# Altium schematic sheet Channel.SchDoc: CDR, Fanout, D-FF
size 420 x 297 mm; CheckedBy: E.Orzes F.Martina S.Baron; CompanyName: CERN; DrawnBy: E.Orzes; Organization: CERN; Address1: European Organization for Nuclear Research; Address2: CH-1211 Genève 23 - Switzerland; SheetNumber: 6; SheetTotal: 7; Projet: Phase Stable Link; DivGrp: EP-ESE; Designer: E.Orzes; ModifiedDate: -
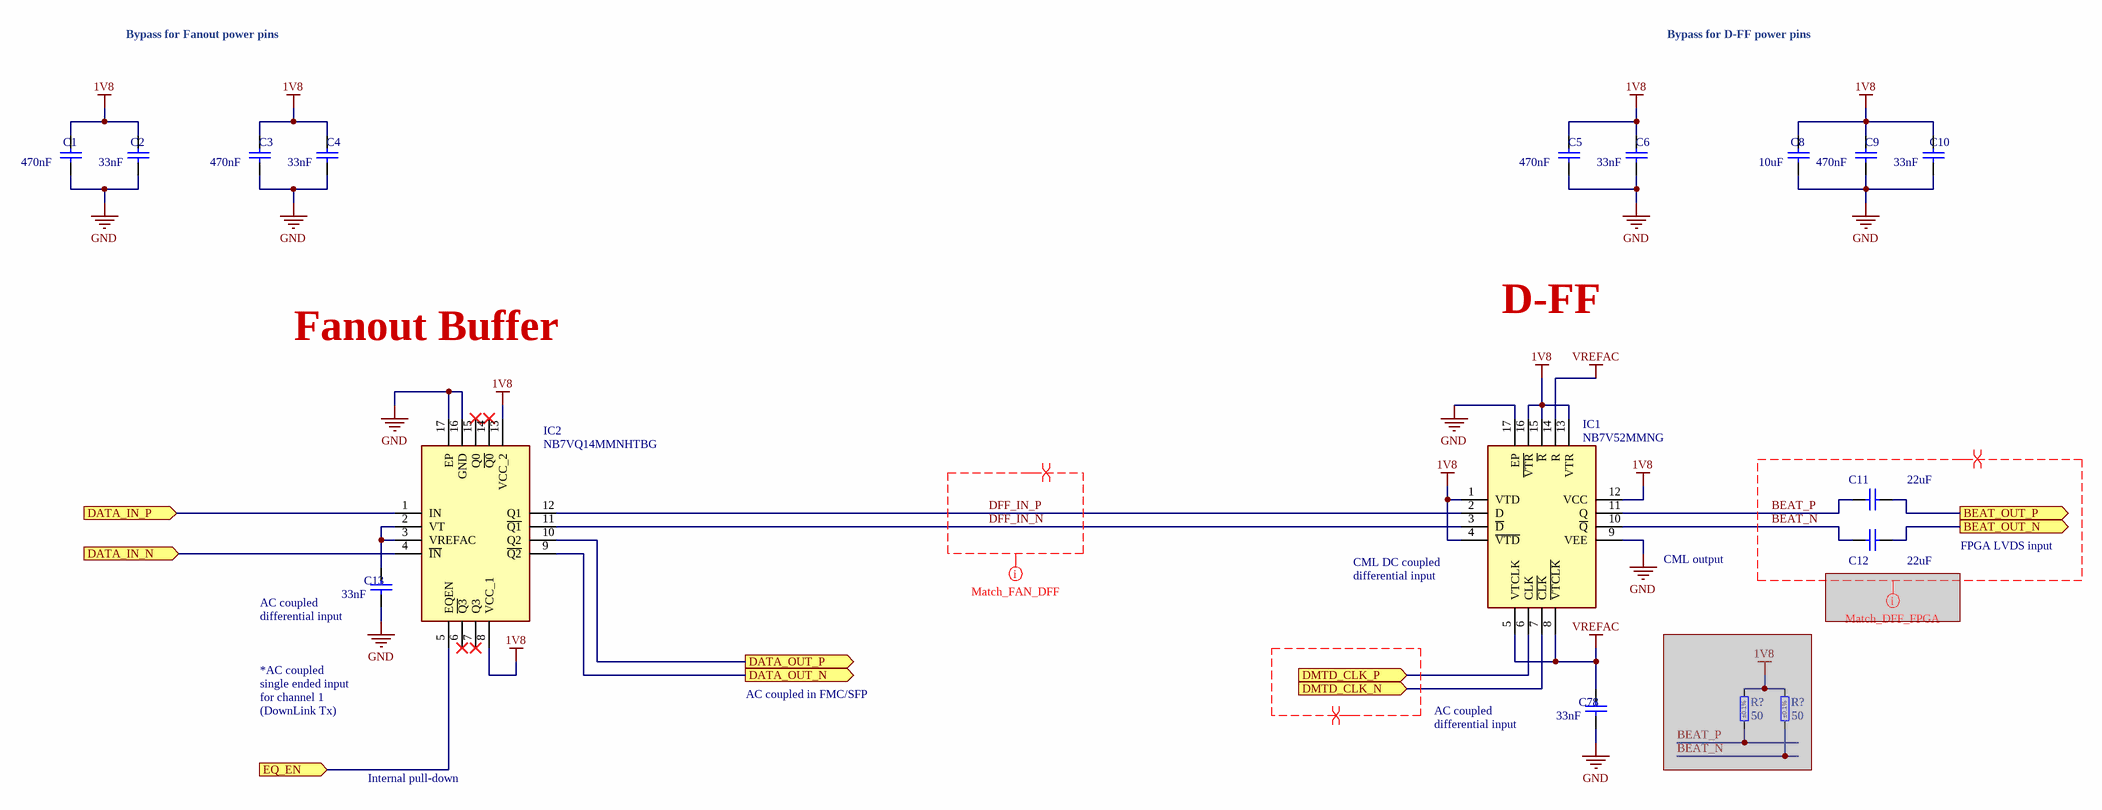
[diagram p0: Channel.SchDoc]

## Parts
(Parts that share a designator on the sheet are numbered #1, #2 ... from top to bottom, then left to right.)
C1  470nF  [CAPC0510X04N]
C2  33nF  [LLL03TR61E333KE01]
C3  470nF  [CAPC0510X04N]
C4  33nF  [LLL03TR61E333KE01]
C5  470nF  [CAPC0510X04N]
C6  33nF  [LLL03TR61E333KE01]
C8  10uF  [CAPC1608X87N]
C9  470nF  [CAPC0510X04N]
C10  33nF  [LLL03TR61E333KE01]
C11  22uF  [MURATA_HI_DENSITY_0402_CAP]
C12  22uF  [MURATA_HI_DENSITY_0402_CAP]
C13  33nF  [LLL03TR61E333KE01]
C78  33nF  [LLL03TR61E333KE01]
IC1  NB7V52MMNG  [QFN50P300X300X100-17N]
IC2  NB7VQ14MMNHTBG  [QFN50P300X300X100-17N]
R?#1  50  Tolerance: ±0.1%  [RESC1005X35N]  (masked out: inside a compile mask, not in the netlist)
R?#2  50  Tolerance: ±0.1%  [RESC1005X35N]  (masked out: inside a compile mask, not in the netlist)

## Ports
BEAT_OUT_N (out), BEAT_OUT_P (out), DATA_IN_N (in), DATA_IN_P (in), DATA_OUT_N (out), DATA_OUT_P (out), DMTD_CLK_N (in), DMTD_CLK_P (in), EQ_EN (in)

## Nets
1V8: C1.2 C2.2 C3.2 C4.2 C5.2 C6.2 C8.2 C9.2 C10.2 IC1.1(VTD) IC1.4(~{VTD}) IC1.12(VCC) IC1.13(VTR) IC1.15(~{R}) IC1.16(~{VTR}) IC2.8(VCC_1) IC2.13(VCC_2)
GND: C1.1 C2.1 C3.1 C4.1 C5.1 C6.1 C8.1 C9.1 C10.1 C13.1 C78.1 IC1.9(VEE) IC1.17(EP) IC2.16(GND) IC2.17(EP)
VREFAC: C78.2 IC1.5(VTCLK) IC1.8(~{VTCLK}) IC1.14(R)
BEAT_N: C12.2 IC1.10(~{Q})
BEAT_OUT_N: C12.1 ; port BEAT_OUT_N
BEAT_OUT_P: C11.1 ; port BEAT_OUT_P
BEAT_P: C11.2 IC1.11(Q)
DATA_IN_N: IC2.4(~{IN}) ; port DATA_IN_N
DATA_IN_P: IC2.1(IN) ; port DATA_IN_P
DATA_OUT_N: IC2.9(~{Q2}) ; port DATA_OUT_N
DATA_OUT_P: IC2.10(Q2) ; port DATA_OUT_P
DFF_IN_N: IC1.3(~{D}) IC2.11(~{Q1})
DFF_IN_P: IC1.2(D) IC2.12(Q1)
DMTD_CLK_N: IC1.7(~{CLK}) ; port DMTD_CLK_N
DMTD_CLK_P: IC1.6(CLK) ; port DMTD_CLK_P
EQ_EN: IC2.5(EQEN) ; port EQ_EN
NetC13_2: C13.2 IC2.2(VT) IC2.3(VREFAC)

Not connected (* = marked no-connect by the designer): IC2 6(~{Q3})* 7(Q3)* 14(~{Q0})* 15(Q0)*

## Layout directives
differential pair: (no net found under the mark), BEAT_N, BEAT_P, DFF_IN_N, DFF_IN_P
net class Match_FAN_DFF: DFF_IN_N, DFF_IN_P
net class Match_DFF_FPGA: BEAT_N, BEAT_P

## Notes on the sheet
- Bypass for Fanout power pins
- Bypass for D-FF power pins
- D-FF
- Fanout Buffer
- (near IC1) CML DC coupled
  differential input
- CML output
- FPGA LVDS input
- (near C13) AC coupled
  differential input
- *AC coupled
  single ended input
  for channel 1 (DownLink Tx)
- AC coupled in FMC/SFP
- AC coupled
  differential input
- Internal pull-down
- Project/Equipment
- Document
- Designer
- Drawn by
- Check.by
- File
- Last Mod.
- Print Date
- Sheet
- Size
- A3
- of
- Rev

## Library data of the parts
C1 C3 C5 C9 = Capacitor - non polarized: LLL153C70G474ME17; Value: 470nF
C2 C4 C6 C10 C13 C78 = Capacitor - non polarized: LLL03TR61E333KE01; Value: 33nF
C8 = CC0603_10UF_6.3V_20%_X5R: C1608X5R1E106M080AC; Part Description: SMD Multilayer Chip Ceramic Capacitor; Manufacturer: GENERIC; Manufacturer1 Part Number: C0603C106M9PAC; Voltage: 6.3V; TC: X5R; Tolerance: ±20%; Part Number: CC0603_10UF_6.3V_20%_X5R; Component Kind: Standard; Component Type: Standard; Pin Count: 2; Value: 10uF; Status: Preferred; Manufacturer Part Number: CC0603_10uF_6.3V_20%_X5R; Case: 0603; Mounted: Yes; Socket: No; SMD: Yes; Sense: No; Manufacturer1 Example: KEMET; Manufacturer1 ComponentHeight: 0.95mm; HelpURL: \\cern.ch\dfs\Applications\Altium\Datasheets\CC0603_X5R_KEMET.pdf; Author: CERN DEM JLC; CreateDate: 03/12/2007; LatestRevisionDate: 03/12/2007
C11 C12 = C0402-22uF-high-density: GRM155R60J226ME11; Vmax: 6.3V; Value: 22uF
IC1 = NB7V52MMNG: Integrated Circuit; Manufacturer_Name: onsemi; Datasheet Link: https://www.onsemi.com/pdf/datasheet/nb7v52m-d.pdf; Height: 1mm; Manufacturer_Part_Number: NB7V52MMNG; Mouser Part Number: 863-NB7V52MMNG; Mouser Price/Stock: https://www.mouser.co.uk/ProductDetail/ON-Semiconductor/NB7V52MMNG?qs=N5dOQkml4H8i91m%252BmwlaUQ%3D%3D; Arrow Part Number: NB7V52MMNG; Arrow Price/Stock: https://www.arrow.com/en/products/nb7v52mmng/on-semiconductor
IC2 = NB7VQ14MMNHTBG: Integrated Circuit; Manufacturer_Name: onsemi; Datasheet Link: http://www.onsemi.com/pub/Collateral/NB7VQ14M-D.PDF; Height: 1mm; Manufacturer_Part_Number: NB7VQ14MMNHTBG; Mouser Part Number: 863-NB7VQ14MMNHTBG; Mouser Price/Stock: https://www.mouser.co.uk/ProductDetail/onsemi/NB7VQ14MMNHTBG?qs=3PKVEWFFm2%2FWq%2FFZ4xstfg%3D%3D; Arrow Part Number: NB7VQ14MMNHTBG; Arrow Price/Stock: https://www.arrow.com/en/products/nb7vq14mmnhtbg/on-semiconductor?utm_currency=USD&region=nac
R?#1 R?#2 = R0402_50R_0.1%_0.05W_25PPM: Resistor - 0.1%; Part Description: Thin Film Precision Resistor; Manufacturer: GENERIC; Manufacturer1 Part Number: FC0402E50R0BTBS; Power: 0.05W; TC: ±25ppm/°C; PressFit: No; Part Number: R0402_50R_0.1%_0.05W_25PPM; Component Kind: Standard; Component Type: Standard; Pin Count: 2; Value: 50; Status: Not Recommended; Manufacturer Part Number: R0402_50R_0.1%_0.05W_25PPM; Case: 0402; Mounted: Yes; Sense: No; Socket: No; SMD: Yes; Manufacturer1 Example: VISHAY DALE; Manufacturer1 ComponentHeight: 0.38mm; HelpURL: \\cern.ch\dfs\Applications\Altium\Datasheets\R0402_VISHAY_FC.pdf; Author: CERN DEM JMW; CreateDate: 8/11/2016; LatestRevisionDate: 8/11/2016